# EAGLE design nintendac_mini (EAGLE 7.7.0)
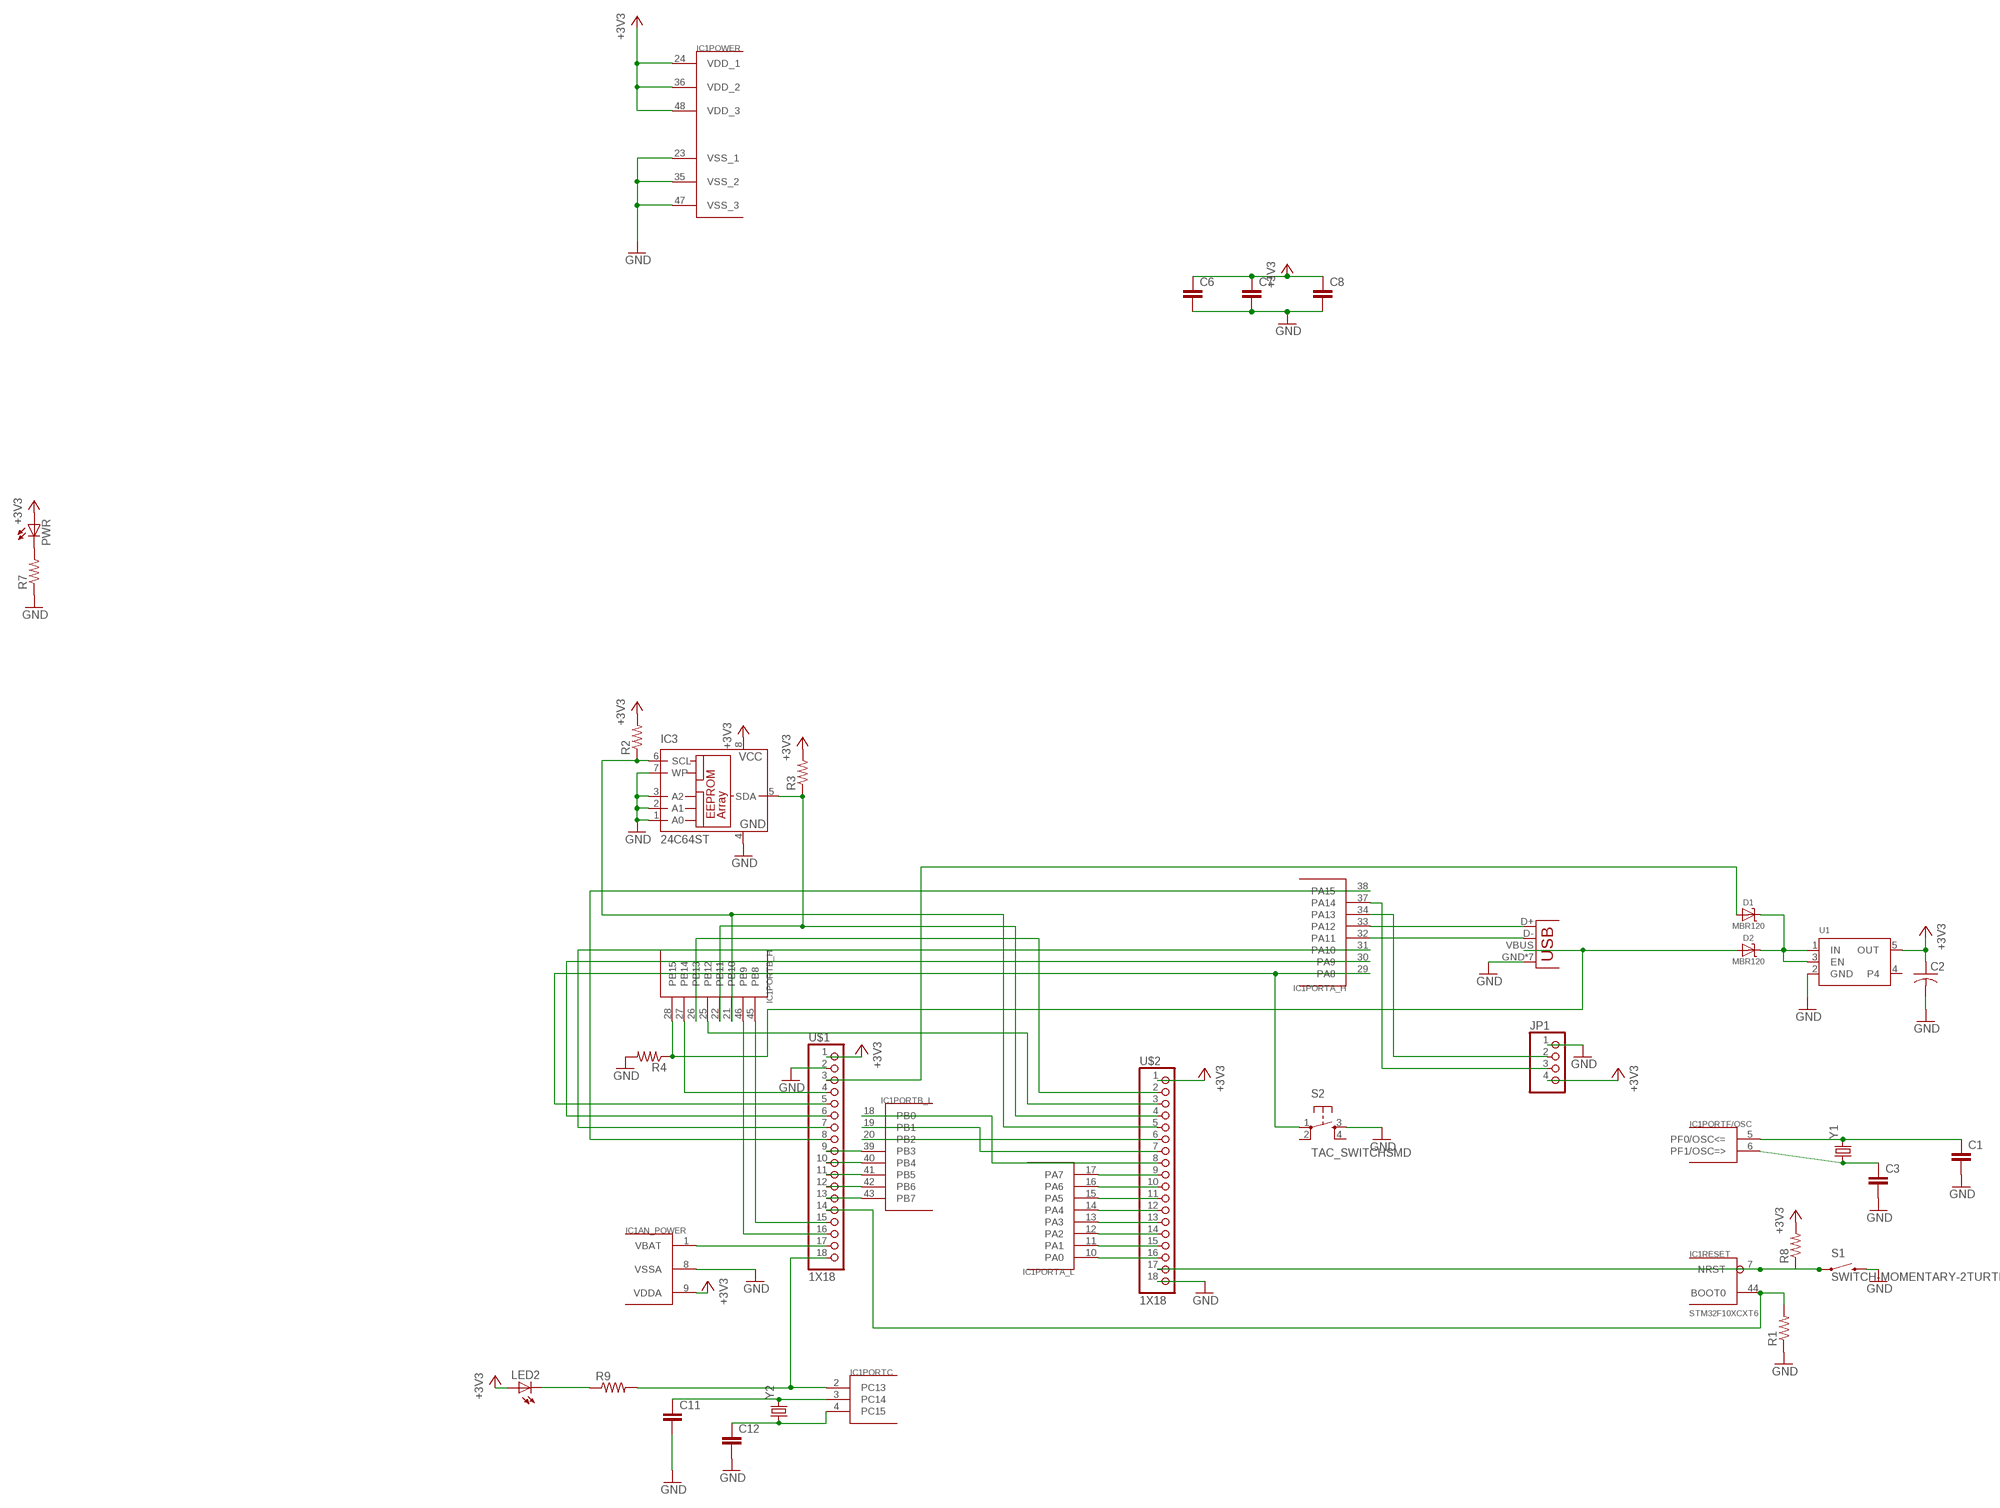
[diagram p0: schematic, sheet 1]

## Parts
C1  CAP0805  [0805]
C2  C-USC1210  [C1210]
C3  CAP0805  [0805]
C6  CAP0805  [0805]
C7  CAP0805  [0805]
C8  CAP0805  [0805]
C11  CAP0805  [0805]
C12  CAP0805  [0805]
D1  MBR120  DIODE-SCHOTTKYSOD-123  [SOD-123]
D2  MBR120  DIODE-SCHOTTKYSOD-123  [SOD-123]
IC1  STM32F10XCXT6  [TQFP48]
IC3  24C64ST  [TSSOP8]
JP1  PINHD-1X4  [1X04]
LED2  LEDCHIP-LED0805  [CHIP-LED0805]
PWR  LEDCHIP-LED0805  [CHIP-LED0805]
R1  RESISTOR0805-RES  [0805]
R2  RESISTOR0805-RES  [0805]
R3  RESISTOR0805-RES  [0805]
R4  RESISTOR0805-RES  [0805]
R7  RESISTOR0805-RES  [0805]
R8  RESISTOR0805-RES  [0805]
R9  RESISTOR0805-RES  [0805]
S1  SWITCH-MOMENTARY-2TURTLE  [KMR2]
S2  TAC_SWITCHSMD  [TACTILE-SWITCH-SMD]
U1  VREG_SOT23-5  [SOT23-5]
U$1  1X18  [1X18]
U$2  1X18  [1X18]
X1  USB-MICROB  [USB-MICROB]
Y1  CRYSTALHC49US  [HC49US]
Y2  CRYSTALTC26H_EZ  [TC26HEZ]

## Nets
+3V3: C2.1 C6.1 C7.1 C8.1 IC1.9(AN_POWER:VDDA) IC1.24(POWER:VDD_1) IC1.36(POWER:VDD_2) IC1.48(POWER:VDD_3) IC3.8(VCC) JP1.4 LED2.A PWR.A R2.2 R3.2 R8.2 U1.5(OUT) U$1.1 U$2.1
GND: C1.2 C2.2 C3.2 C6.2 C7.2 C8.2 C11.2 C12.2 IC1.8(AN_POWER:VSSA) IC1.23(POWER:VSS_1) IC1.35(POWER:VSS_2) IC1.47(POWER:VSS_3) IC3.1(A0) IC3.2(A1) IC3.3(A2) IC3.4(GND) IC3.7(WP) JP1.1 R1.1 R4.2 R7.1 S1.3 S2.3 U1.2(GND) U$1.2 U$2.18 X1.GND X1.P1(GND) X1.P2(GND) X1.P3(GND) X1.P4(GND) X1.P5(GND) X1.P6(GND)
N$1: IC1.7(RESET:NRST) R8.1 S1.1 U$2.17
N$2: D1.A U$1.3
N$3: IC1.44(RESET:BOOT0) R1.2 U$1.14
N$4: IC1.33(PORTA_H:PA12) X1.D+
N$5: C1.1 IC1.5(PORTF/OSC:PF0/OSC<=) Y1.2
N$6: C3.1 IC1.6(PORTF/OSC:PF1/OSC=>) Y1.1
N$7: IC1.32(PORTA_H:PA11) X1.D-
N$8: IC1.34(PORTA_H:PA13) JP1.2
N$9: IC1.37(PORTA_H:PA14) JP1.3
N$10: IC1.10(PORTA_L:PA0) U$2.16
N$11: IC1.11(PORTA_L:PA1) U$2.15
N$12: IC1.12(PORTA_L:PA2) U$2.14
N$13: IC1.13(PORTA_L:PA3) U$2.13
N$14: IC1.14(PORTA_L:PA4) U$2.12
N$15: IC1.15(PORTA_L:PA5) U$2.11
N$16: IC1.16(PORTA_L:PA6) U$2.10
N$17: IC1.17(PORTA_L:PA7) U$2.9
N$18: IC1.21(PORTB_H:PB10) IC3.6(SCL) R2.1 U$2.5
N$19: IC1.22(PORTB_H:PB11) IC3.5(SDA) R3.1 U$2.4
N$20: IC1.18(PORTB_L:PB0) U$2.8
N$21: IC1.19(PORTB_L:PB1) U$2.7
N$22: IC1.20(PORTB_L:PB2) U$2.6
N$23: IC1.43(PORTB_L:PB7) U$1.13
N$24: IC1.42(PORTB_L:PB6) U$1.12
N$25: IC1.41(PORTB_L:PB5) U$1.11
N$26: IC1.40(PORTB_L:PB4) U$1.10
N$27: PWR.C R7.2
N$28: C11.1 IC1.3(PORTC:PC14) Y2.2
N$29: C12.1 IC1.4(PORTC:PC15) Y2.1
N$30: IC1.39(PORTB_L:PB3) U$1.9
N$31: D1.C D2.C U1.1(IN) U1.3(EN)
N$32: IC1.2(PORTC:PC13) R9.2 U$1.18
N$33: IC1.1(AN_POWER:VBAT) U$1.17
N$34: IC1.46(PORTB_H:PB9) U$1.16
N$35: IC1.45(PORTB_H:PB8) U$1.15
N$38: IC1.25(PORTB_H:PB12) U$2.3
N$39: IC1.26(PORTB_H:PB13) U$2.2
N$40: IC1.38(PORTA_H:PA15) U$1.8
N$41: IC1.31(PORTA_H:PA10) U$1.7
N$42: IC1.30(PORTA_H:PA9) U$1.6
N$43: IC1.29(PORTA_H:PA8) S2.1 U$1.5
N$44: IC1.27(PORTB_H:PB14) U$1.4
N$45: D2.A IC1.28(PORTB_H:PB15) R4.1 X1.VBUS
N$65: LED2.C R9.1
Unconnected: S2.2 S2.4 U1.4

## Library data of the parts
C1 C3 C6-C8 C11 C12 = backplane:CAP: Capacitor Standard 0603 ceramic capacitor, and 0.1" leaded capacitor.
C2 = backplane:C-US: CAPACITOR, American symbol
D1 D2 = microbuilder:DIODE-SCHOTTKY
IC1 = stm32f072c8t6:STM32F10XCXT6: ST STM32F101/103 48pin LQFP
IC3 = microchip:24*: Serial EEPROM I2C; MPN: CAT24C64YI-GT3; OC_FARNELL: 1718133; OC_NEWARK: 08R5418
JP1 = pinhead:PINHD-1X4: PIN HEADER
LED2 PWR = backplane:LED: LED OSRAM: - CHIPLED LG R971, LG N971, LY N971, LG Q971, LY Q971, LO R971, LY R971 LH N974, LH R974 LS Q976, LO Q976, LY Q976 LO Q996 - Hyper CHIPLED LW Q18S LB Q993, LB Q99A, LB R99A - SideLED LS A670, LO A670, LY A670, LG A670, LP A670 LB A673, LV A673, LT A673, LW A673 LH A674 LY A675 LS A676, LA A676, LO A676, LY A676, LW A676 LS A679, LY A679, LG A679 - Hyper Micro SIDELED® LS Y876, LA Y876, LO Y876, LY Y876 LT Y87S - SmartLED LW L88C, LW L88S LB L89C, LB L89S, LG L890 LS L89K, LO L89K, LY L89K LS L896, LA L896, LO L896, LY L896 - TOPLED LS T670, LO T670, LY T670, LG T670, LP T670 LSG T670, LSP T670, LSY T670, LOP T670, LYG T670 LG T671, LOG T671, LSG T671 LB T673, LV T673, LT T673, LW T673 LH T674 LS T676, LA T676, LO T676, LY T676, LB T676, LH T676, LSB T676, LW T676 LB T67C, LV T67C, LT T67C, LS T67K, LO T67K, LY T67K, LW E67C LS E67B, LA E67B, LO E67B, LY E67B, LB E67C, LV E67C, LT E67C LW T67C LS T679, LY T679, LG T679 LS T770, LO T770, LY T770, LG T770, LP T770 LB T773, LV T773, LT T773, LW T773 LH T774 LS E675, LA E675, LY E675, LS T675 LS T776, LA T776, LO T776, LY T776, LB T776 LHGB T686 LT T68C, LB T68C - Hyper Mini TOPLED® LB M676 - Mini TOPLED Santana® LG M470 LS M47K, LO M47K, LY M47K Source: http://www.osram.convergy.de/
R1-R4 R7-R9 = SparkFun-Passives:RESISTOR: Resistor Basic schematic elements and footprints for 0603, 1206, and PTH resistors.
S1 = Adafruit Feather M0 Adalogger:SWITCH-MOMENTARY-2: Various NO switches- pushbuttons, reed, etc
S2 = SparkFun-Retired:TAC_SWITCH: Momentary Switch Button commonly used for reset or general input. Spark Fun Electronics SKU : COM-00097 SMT- SWCH-08247; PROD_ID: SWCH-08247
U1 = Adafruit Feather M0 Adalogger:VREG_SOT23-5: SOT23-5 Fixed Voltage Regulators Part Current Out V Out V In V Dropout ?JA (°C/W) TJ (°C) Digikey Part No. ADP121 150mA 3.3V 3.4-5.5V 0.09V @ 150mA -- -- ADP121-AUJZ33R7CT-ND ADP121 150mA 3.0V 3.1-5.5V 0.09V @ 150mA -- -- ADP121-AUJZ30R7CT-ND ADP122 300mA 3.3V 3.4-5.5V 0.085V @ 300mA -- -- ADP122AUJZ-3.3-R7CT-ND ADP1712 300mA 3.3V 3.5-5.5V 0.17V @ 300mA -- -- ADP1712AUJZ-3.3-R7TR-ND AP7311 (Low Cost) 150mA 3.3V 3.5-6V 0.15V @ 150mA -- -- AP7311-33WG-7DICT-ND LD39015M18R 150mA 1.8V 1.9V-5.5V 0.08V @ 100mA -- -- 497-6977-1-ND LP2985A-33DBVR 150mA 3.3V 3.3-16V 0.28V @ 150mA 206 150 296-18479-1-ND MCP1824T-3302E/OT 300mA 3.3V 3.5V-6V 0.2V @ 300mA -- -- MCP1824T-3302E/OTCT-ND MIC5205-2.5YM5 TR 150mA 2.5V 2.7-16V 0.165V @ 150mA -- -- 576-1257-2-ND MIC5205-3.0YM5 TR 150mA 3.0V 3.2V-16V 0.165V @ 150mA -- -- 576-1258-2-ND MIC5205-3.3YM5 TR 150mA 3.3V 3.5V-16V 0.165V @ 150mA -- -- 576-1259-2-ND TPS780330220 150mA 3.3V+2.2V 3.6-5.5V 250mV Max -- -- 296-23332-1-ND TDA3663/N1,135 100mA 3.3V 3.5-45V 0.18V @ 50mA -- -- 568-5343-1-ND Max operating temp can be calculated using ?JA, TJ (max junction temperature), and power in watts. Set the "Maximum Ambient Temperature" until it reaches TJ ("Max Junction Temperature"), which is the absolute limit for safe use of the regulator: Heat Sink Temperature Calculator <http://www.daycounter.com/Calculators/Heat-Sink-Temperature-Calculator.phtml> For example, With 12V source into a 3.3V LP2985 and a 30mA load, we are dissipating (12V-3.3V) * 0.03A = 0.261W. With a ?JA of 206 °C/W, a TJ of 150°C, and 261mW we can safely use the chip without a heat sink up to 75°C (=147.1°C Junction Temperature).
U$1 U$2 = headers(2mm):1X18
X1 = backplane:USB: USB Connectors USB-B-PTH is fully proven SKU : PRT-00139/CONN-08278 USB-miniB is fully proven SKU : PRT-00587 USB-A-PCB is untested. USB-A-H is throughly reviewed, but untested. Spark Fun Electronics SKU : PRT-00437 USB-B-SMT is throughly reviewed, but untested. Needs silkscreen touching up. USB-A-S has not been used/tested USB-MB-H has not been used/tested USB-MICROB has been used. CONN-09505; PROD_ID: CONN-09505
Y1 Y2 = backplane:CRYSTAL: Various standard crystals. Proven footprints.

## Board
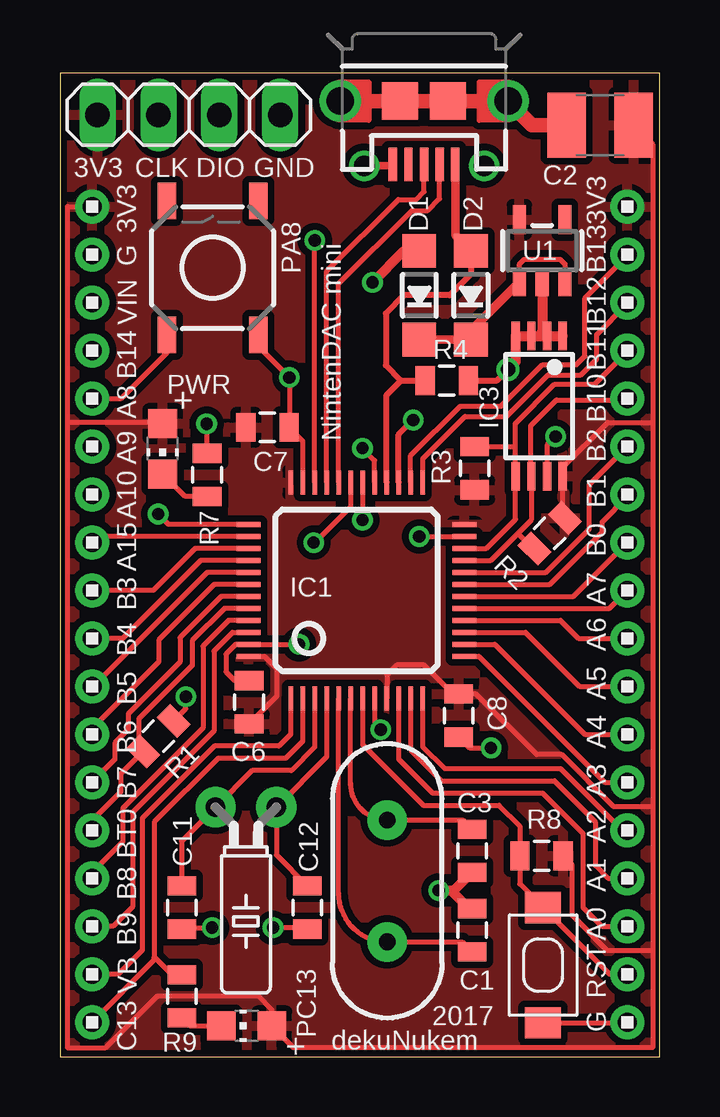
[diagram p1: board, top side]
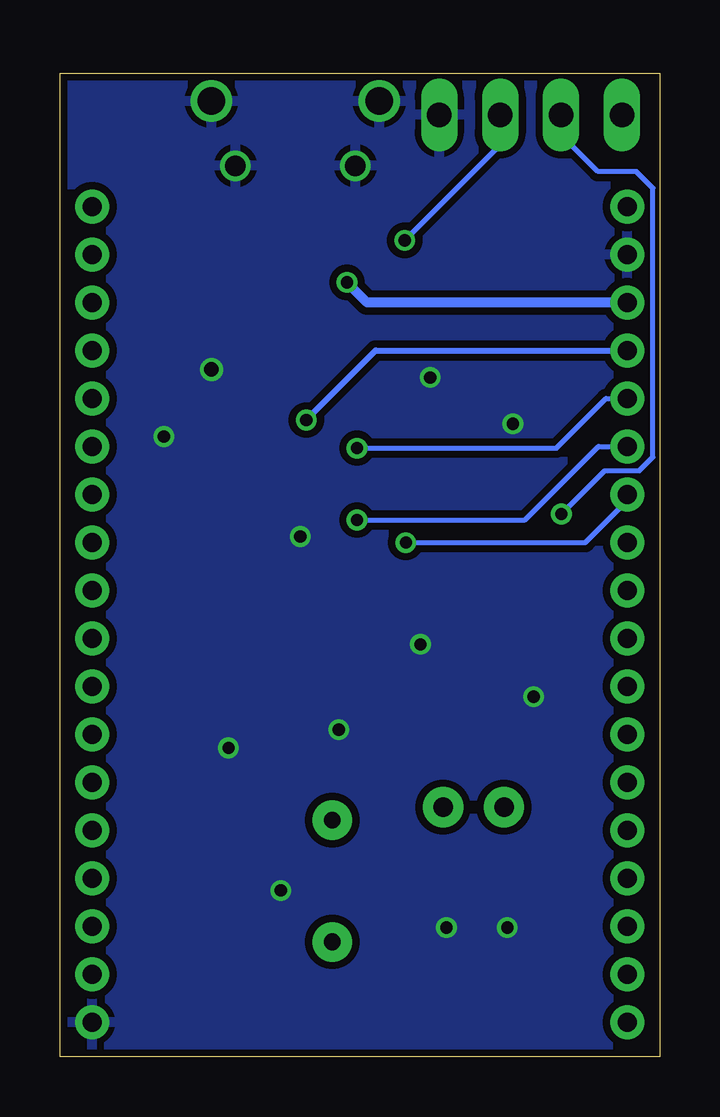
[diagram p2: board, bottom side, seen from below]

Size 25 x 41 mm. Coordinates in mm from the lower left corner, seen from the top.
Outline: 0,0 25,0 25,41 0,41 0,0
Copper layers (1*16): Top 0.035mm / dielectric 1.5mm / Bottom 0.035mm
Design rules "SparkFun-2-layer-TIGHT": minimum track width 7mil, minimum drill 15mil, track to track 7mil, track to pad 7mil, pad to pad 7mil, via to via 7mil, smd to smd 7mil, copper to edge 7mil, drill to drill 7mil, minimum pad ring 7mil, minimum via ring 7mil, stop-mask expansion 4mil, vias tented up to drill 25mil, thermal gap 10mil

### Footprints (pad centres in the part's own frame; a part is rotated, then mirrored left to right if it is on the bottom)
0805 = smd 0.8 x 1.2: 1 -0.9,0; 2 0.9,0
C1210 = smd 1.6 x 2.7: 1 -1.4,0; 2 1.4,0
SOD-123 = smd 1.4 x 1.4: A 1.85,0; C -1.85,0
TQFP48 = smd 0.2 x 1: 1 -2.75,-4.5; 2 -2.25,-4.5; 3 -1.75,-4.5; 4 -1.25,-4.5; 5 -0.75,-4.5; 6 -0.25,-4.5; 7 0.25,-4.5; 8 0.75,-4.5; 9 1.25,-4.5; 10 1.75,-4.5; 11 2.25,-4.5; 12 2.75,-4.5; 25 2.75,4.5; 26 2.25,4.5; 27 1.75,4.5; 28 1.25,4.5; 29 0.75,4.5; 30 0.25,4.5; 31 -0.25,4.5; 32 -0.75,4.5; 33 -1.25,4.5; 34 -1.75,4.5; 35 -2.25,4.5; 36 -2.75,4.5 | smd 1 x 0.2: 13 4.5,-2.75; 14 4.5,-2.25; 15 4.5,-1.75; 16 4.5,-1.25; 17 4.5,-0.75; 18 4.5,-0.25; 19 4.5,0.25; 20 4.5,0.75; 21 4.5,1.25; 22 4.5,1.75; 23 4.5,2.25; 24 4.5,2.75; 37 -4.5,2.75; 38 -4.5,2.25; 39 -4.5,1.75; 40 -4.5,1.25; 41 -4.5,0.75; 42 -4.5,0.25; 43 -4.5,-0.25; 44 -4.5,-0.75; 45 -4.5,-1.25; 46 -4.5,-1.75; 47 -4.5,-2.25; 48 -4.5,-2.75
TSSOP8 = smd 0.35 x 1.2: 1 -0.975,-2.925; 2 -0.325,-2.925; 3 0.325,-2.925; 4 0.975,-2.925; 5 0.975,2.925; 6 0.325,2.925; 7 -0.325,2.925; 8 -0.975,2.925
1X04 = drill 1.016 long: 1 -3.81,0; 2 -1.27,0; 3 1.27,0; 4 3.81,0
CHIP-LED0805 = smd 1.2 x 1.2: A 0,-1.05; C 0,1.05
KMR2 = smd 1.3 x 1.5: 1 2.4,0; 3 -2.4,0
TACTILE-SWITCH-SMD = smd 1.524 x 0.762: 1 -2.794,1.905; 2 2.794,1.905; 3 -2.794,-1.905; 4 2.794,-1.905
SOT23-5 = smd 0.55 x 1.2: 1 -0.95,-1.3; 2 0,-1.3; 3 0.95,-1.3; 4 0.95,1.3; 5 -0.95,1.3
1X18 = drill 0.8 pad 1.422: 1 -9,0; 2 -7,0; 3 -5,0; 4 -3,0; 5 -1,0; 6 1,0; 7 3,0; 8 5,0; 9 7,0; 10 9,0; 11 11,0; 12 13,0; 13 15,0; 14 17,0; 15 19,0; 16 21,0; 17 23,0; 18 25,0
USB-MICROB = smd 0.35 x 1.4: D+ 0,2.65; D- -0.65,2.65; GND 1.3,2.65; ID 0.65,2.65; VBUS -1.3,2.65 | smd 1.5 x 1.55: P1 -1,0; P2 1,0 | drill 1.15 pad 1.422: P3 -3.5,0; P4 3.5,0 | drill 0.85 pad 1.27: P5 -2.5,2.7; P6 2.5,2.7
HC49US = drill 0.7 pad 1.651: 1 -2.54,0; 2 2.54,0
TC26HEZ = drill 0.813 pad 1.676: 1 -1.27,0; 2 1.27,0

### Placement (x,y rotation side)
C1  17.19,5.28 90 top
C2  22.52,38.84 180 top
C3  17.19,8.59 270 top
C6  7.89,14.78 90 top
C7  8.65,26.24 0 top
C8  16.63,14.22 270 top
C11  5.08,6.22 270 top
C12  10.31,6.22 270 top
D1  14.99,31.75 90 top
D2  17.14,31.75 90 top
IC1  12.37,19.44 0 top
IC3  19.98,27.13 180 top
JP1  5.38,39.27 180 top
LED2  7.78,1.3 90 top
PWR  4.28,25.35 180 top
R1  4.11,13.36 225 top
R2  20.41,21.82 45 top
R3  17.29,24.54 270 top
R4  16.13,28.19 0 top
R7  6.14,24.26 270 top
R8  20.08,8.38 0 top
R9  5.08,2.52 90 top
S1  20.14,3.83 90 top
S2  6.37,32.89 90 top
U1  20.11,33.6 0 top
U$1  1.34,26.44 270 top
U$2  23.66,26.44 270 top
X1  15.18,39.84 180 top
Y1  13.64,7.33 270 top
Y2  7.76,10.41 180 top

### Tracks (layer width: path | path; a pad name or v marks a point on that pad's centre or on a via)
+3V3
  Top 0.203: 7.89,16.68 IC1.48 8.52,16.69 9.03,16.18 9.03,15.03 C6.1 | IC1.9 13.63,15.93 14.04,16.33 15.18,16.33 16.39,15.12 C8.1 17.35,15.12 19.88,12.6 20.92,12.6 23.08,10.44 24.71,10.44 | R2.2 20.95,22.55 IC3.8 20.95,24.56 22.84,26.44 24.71,26.44 | R8.2 21.34,8.03 21.34,5.92 22.81,4.45 24.71,4.45 | U$1.1 0.3,35.44 0.3,26.44 | 4.28,26.44 PWR.A 4.24,26.44 0.3,26.44 | 24.71,26.44 24.71,10.44 | 24.71,10.44 24.71,4.45 | 24.71,4.45 24.71,0.38 9.75,0.38 LED2.A 8.83,1.96 8.26,2.54 4.06,2.54 1.91,0.38 0.3,0.38 0.3,26.44 | C2.1 24.71,38.04 24.71,26.44
  pour Top (isolate 0.279): 0,41 25,41 25,0 0,0
GND  (via drill 0.51, 0.6)
  Top 0.203: C6.2 7.88,15.7 7.28,15.7 6.92,16.05 6.92,16.79 7.33,17.19 IC1.47 v9.97,17.19 v9.97,17.2 | IC1.35 10.12,25.67 C7.2 9.57,26.25 v9.57,28.32 8.27,29.62 S2.3 | IC1.8 13.12,13.89 v13.38,13.64 | C8.2 17.07,12.88 v17.97,12.88 | v14.98,21.69 IC1.23 | v6.11,26.39 6.11,25.18 R7.1 | S1.3 23.64,1.43 U$2.18 | C12.2 10.25,5.38 v8.89,5.38 | v20.67,25.86 20.3,25.5 IC3.7 | R1.1 5.25,14.5 v5.25,15.01 | C11.2 5.14,5.38 v6.35,5.38
  Top 0.254: R4.2 18.23,28.19 v18.68,28.65
  Top 0.305: X1.GND 13.83,37.14 X1.P6
  Top 0.406: v15.79,6.93 16.3,6.93 | 16.3,6.93 16.43,6.93 C3.2 | C1.2 17.05,6.18 16.3,6.93 | IC3.2 IC3.3 IC3.4 19,28.97 v18.68,28.65 | IC3.2 IC3.1 | U1.2 20.11,30.25 IC3.2
  Top 0.61: X1.P4 X1.P2 X1.P1 X1.P3 19.69,38.84 C2.2
  pour Bottom (isolate 0.305): 0,41 25,41 25,0 0,0
N$1
  Top 0.203: IC1.7 12.62,13.02 15.15,10.49 18.3,10.49 19.17,9.63 19.17,8.4 | 19.17,8.4 R8.1 | 19.17,8.4 19.17,7.2 S1.1 22.93,3.44 U$2.17
N$2  (via drill 0.51)
  Top 0.406: v13.03,32.28 14.35,33.6 D1.A
  Bottom 0.406: U$1.3 12.19,31.44 v13.03,32.28
N$3
  Top 0.203: IC1.44 6.86,18.69 5.51,17.35 5.51,16.31 3.29,14.09 3.29,12.9 R1.2 2.54,11.79 2.54,11.05 1.34,9.85 U$1.14
N$4
  Top 0.203: IC1.33 11.12,32.75 14.11,35.74 14.86,35.74 15.18,36.06 X1.D+
N$5
  Top 0.203: 17.16,4.41 C1.1 16.78,4.79 Y1.2 arc-90 11.62,6.81 IC1.5
N$6
  Top 0.203: C3.1 16.8,9.87 Y1.1 arc-90 12.12,11.39 IC1.6
N$7
  Top 0.203: IC1.32 11.62,32.23 14.67,35.28 15.34,35.28 15.83,35.77 X1.D-
N$8  (via drill 0.51)
  Top 0.203: 10.63,23.94 IC1.34 v10.62,34.04
  Bottom 0.203: v10.62,34.04 6.64,38.02 JP1.2
N$9  (via drill 0.51 pad 0.51)
  Top 0.203: IC1.37 4.53,22.19 v4.09,22.63
  Bottom 0.203: v4.09,22.63 2.29,24.43 0.84,24.43 0.28,24.99 0.28,36.22 0.96,36.91 2.56,36.91 4.11,38.45 JP1.3
N$10
  Top 0.203: IC1.10 14.12,12.41 15.54,11 20.12,11 21.81,9.31 21.81,6.22 22.59,5.44 U$2.16
N$11
  Top 0.203: IC1.11 14.62,12.8 15.92,11.51 20.61,11.51 22.32,9.8 22.32,7.98 22.85,7.44 U$2.15
N$12
  Top 0.203: IC1.12 15.12,12.93 16.04,12.01 20.87,12.01 23.44,9.44 U$2.14
N$13
  Top 0.203: IC1.13 17.46,16.69 22.71,11.44 U$2.13
N$14
  Top 0.203: IC1.14 18.13,17.19 21.88,13.44 U$2.12
N$15
  Top 0.203: IC1.15 19.41,17.69 21.66,15.44 U$2.11
N$16
  Top 0.203: IC1.16 20.86,18.19 21.61,17.44 U$2.10
N$17
  Top 0.203: IC1.17 22.91,18.69 U$2.9
N$18
  Top 0.203: IC1.21 17.96,20.69 19.08,21.81 | 19.08,21.81 19.68,22.4 19.68,24.18 IC3.6 19.63,24.23 19.63,26.31 20.7,27.38 23.6,27.38 U$2.5 | 19.08,21.81 19.71,21.18 R2.1
N$19
  Top 0.203: IC1.22 17.78,21.19 18.99,22.4 18.99,24.19 IC3.5 18.98,24.23 18.98,25.4 | 18.98,25.4 18.98,26.4 20.62,28.04 22.31,28.04 23.66,29.39 U$2.4 | R3.1 18.94,25.44 18.98,25.4
N$20
  Top 0.203: IC1.18 21.41,19.19 U$2.8
N$21
  Top 0.203: IC1.19 20.43,19.69 22.61,21.87 22.61,22.3 23.66,23.35 U$2.7
N$22
  Top 0.203: IC1.20 20.27,20.19 22.07,22 22.07,23.86 U$2.6
N$23
  Top 0.203: IC1.43 6.72,19.19 5,17.48 5,16.46 2.85,14.3 2.85,13.64 2.29,13.08 2.29,12.39 U$1.13
N$24
  Top 0.203: IC1.42 6.43,19.69 4.12,17.37 4.12,16.47 1.34,13.7 U$1.12
N$25
  Top 0.203: IC1.41 6.14,20.19 1.39,15.44 U$1.11
N$26
  Top 0.203: IC1.40 5.87,20.69 2.62,17.44 U$1.10
N$27
  Top 0.203: R7.2 5.22,23.36 PWR.C
N$28
  Top 0.203: C11.1 5.07,7.13 5.07,8.99 Y2.2 8.02,11.94 9.65,11.94 10.62,12.91 IC1.3
N$29
  Top 0.203: C12.1 9.03,8.41 Y2.1 11.12,12.51 IC1.4
N$30
  Top 0.203: IC1.39 5.64,21.19 3.89,19.44 U$1.9
N$31
  Top 0.203: U1.1 19.16,33.05 19.36,33.25 20.85,33.25 21.06,33.05 U1.3
  Top 0.356: D1.C D2.C 17.14,30.28 U1.1
N$32
  Top 0.203: IC1.2 10.12,13.16 9.41,12.45 6.59,12.45 3.94,9.79 3.94,4.17 | R9.2 4.68,3.42 3.94,4.17 | U$1.18 3.94,4.03 3.94,4.17
N$33
  Top 0.203: IC1.1 9.62,13.44 9.13,12.95 6.44,12.95 3.43,9.94 3.43,4.45 2.42,3.44 U$1.17
N$34
  Top 0.203: IC1.46 7.19,17.69 6.42,16.92 6.42,13.58 3.02,10.19 3.02,6.25 2.21,5.44 U$1.16
N$35
  Top 0.203: IC1.45 7.03,18.19 5.96,17.12 5.96,13.71 2.62,10.36 2.62,8.97 1.34,7.7 U$1.15
N$38
  Top 0.203: IC1.25 15.13,24.93 16.89,26.7 18.62,26.7 20.34,28.42 21.72,28.42 22.38,29.08 22.38,30.11 23.66,31.39 U$2.3
N$39
  Top 0.203: U$2.2 23.66,33.39 21.89,31.63 21.89,29.21 21.54,28.85 20.12,28.85 18.39,27.13 16.69,27.13 14.62,25.06 IC1.26
N$40
  Top 0.203: IC1.38 1.59,21.69 U$1.8
N$41  (via drill 0.5)
  Top 0.203: IC1.31 12.12,22.93 10.63,21.44 v10.58,21.44
  Bottom 0.203: v10.58,21.44 3.09,21.44 1.34,23.19 U$1.7
N$42  (via drill 0.5)
  Top 0.203: IC1.30 12.62,22.39 v12.61,22.38
  Bottom 0.203: v12.61,22.38 5.61,22.38 2.55,25.44 U$1.6
N$43  (via drill 0.5)
  Top 0.203: IC1.29 13.12,24.86 v12.61,25.38 | U$1.5 2.55,27.44 4.46,29.35 S2.1
  Bottom 0.203: v12.61,25.38 4.3,25.38 2.23,27.44 U$1.5
N$44  (via drill 0.51)
  Top 0.254: IC1.27 14.12,25.93 v14.73,26.54
  Bottom 0.254: v14.73,26.54 11.83,29.44 U$1.4
N$45
  Top 0.254: D2.A 17.14,32.63 16.26,31.75 14.35,31.75 13.59,30.99 13.59,28.83 14.22,28.19 | 14.22,28.19 R4.1 | IC1.28 13.62,27.59 14.22,28.19
  Top 0.356: D2.A 16.48,34.26 X1.VBUS
N$65
  Top 0.203: R9.1 5.41,1.29 LED2.C

### Text on the board
tNames: 3V3 | CLK | DIO | GND | 3V3 | 3V3 | G | PA8 | B13 | VIN | B14 | B12 | B11 | A8 | PWR | A9 | NintenDAC mini | B10 | B2 | A10 | B1 | A15 | B0 | B3 | A7 | B4 | A6 | B5 | A5 | B6 | A4 | B7 | A3 | BT0 | A2 | B8 | A1 | B9 | A0 | VB | C13 | RST | PC13 | 2017 | G | dekuNukem